# Altium project 388D_Control_v1.PrjPcb (part 2 of 3)

## Sheet 3.ADC.SchDoc
size A3; SheetNumber: 4; SheetTotal: 10
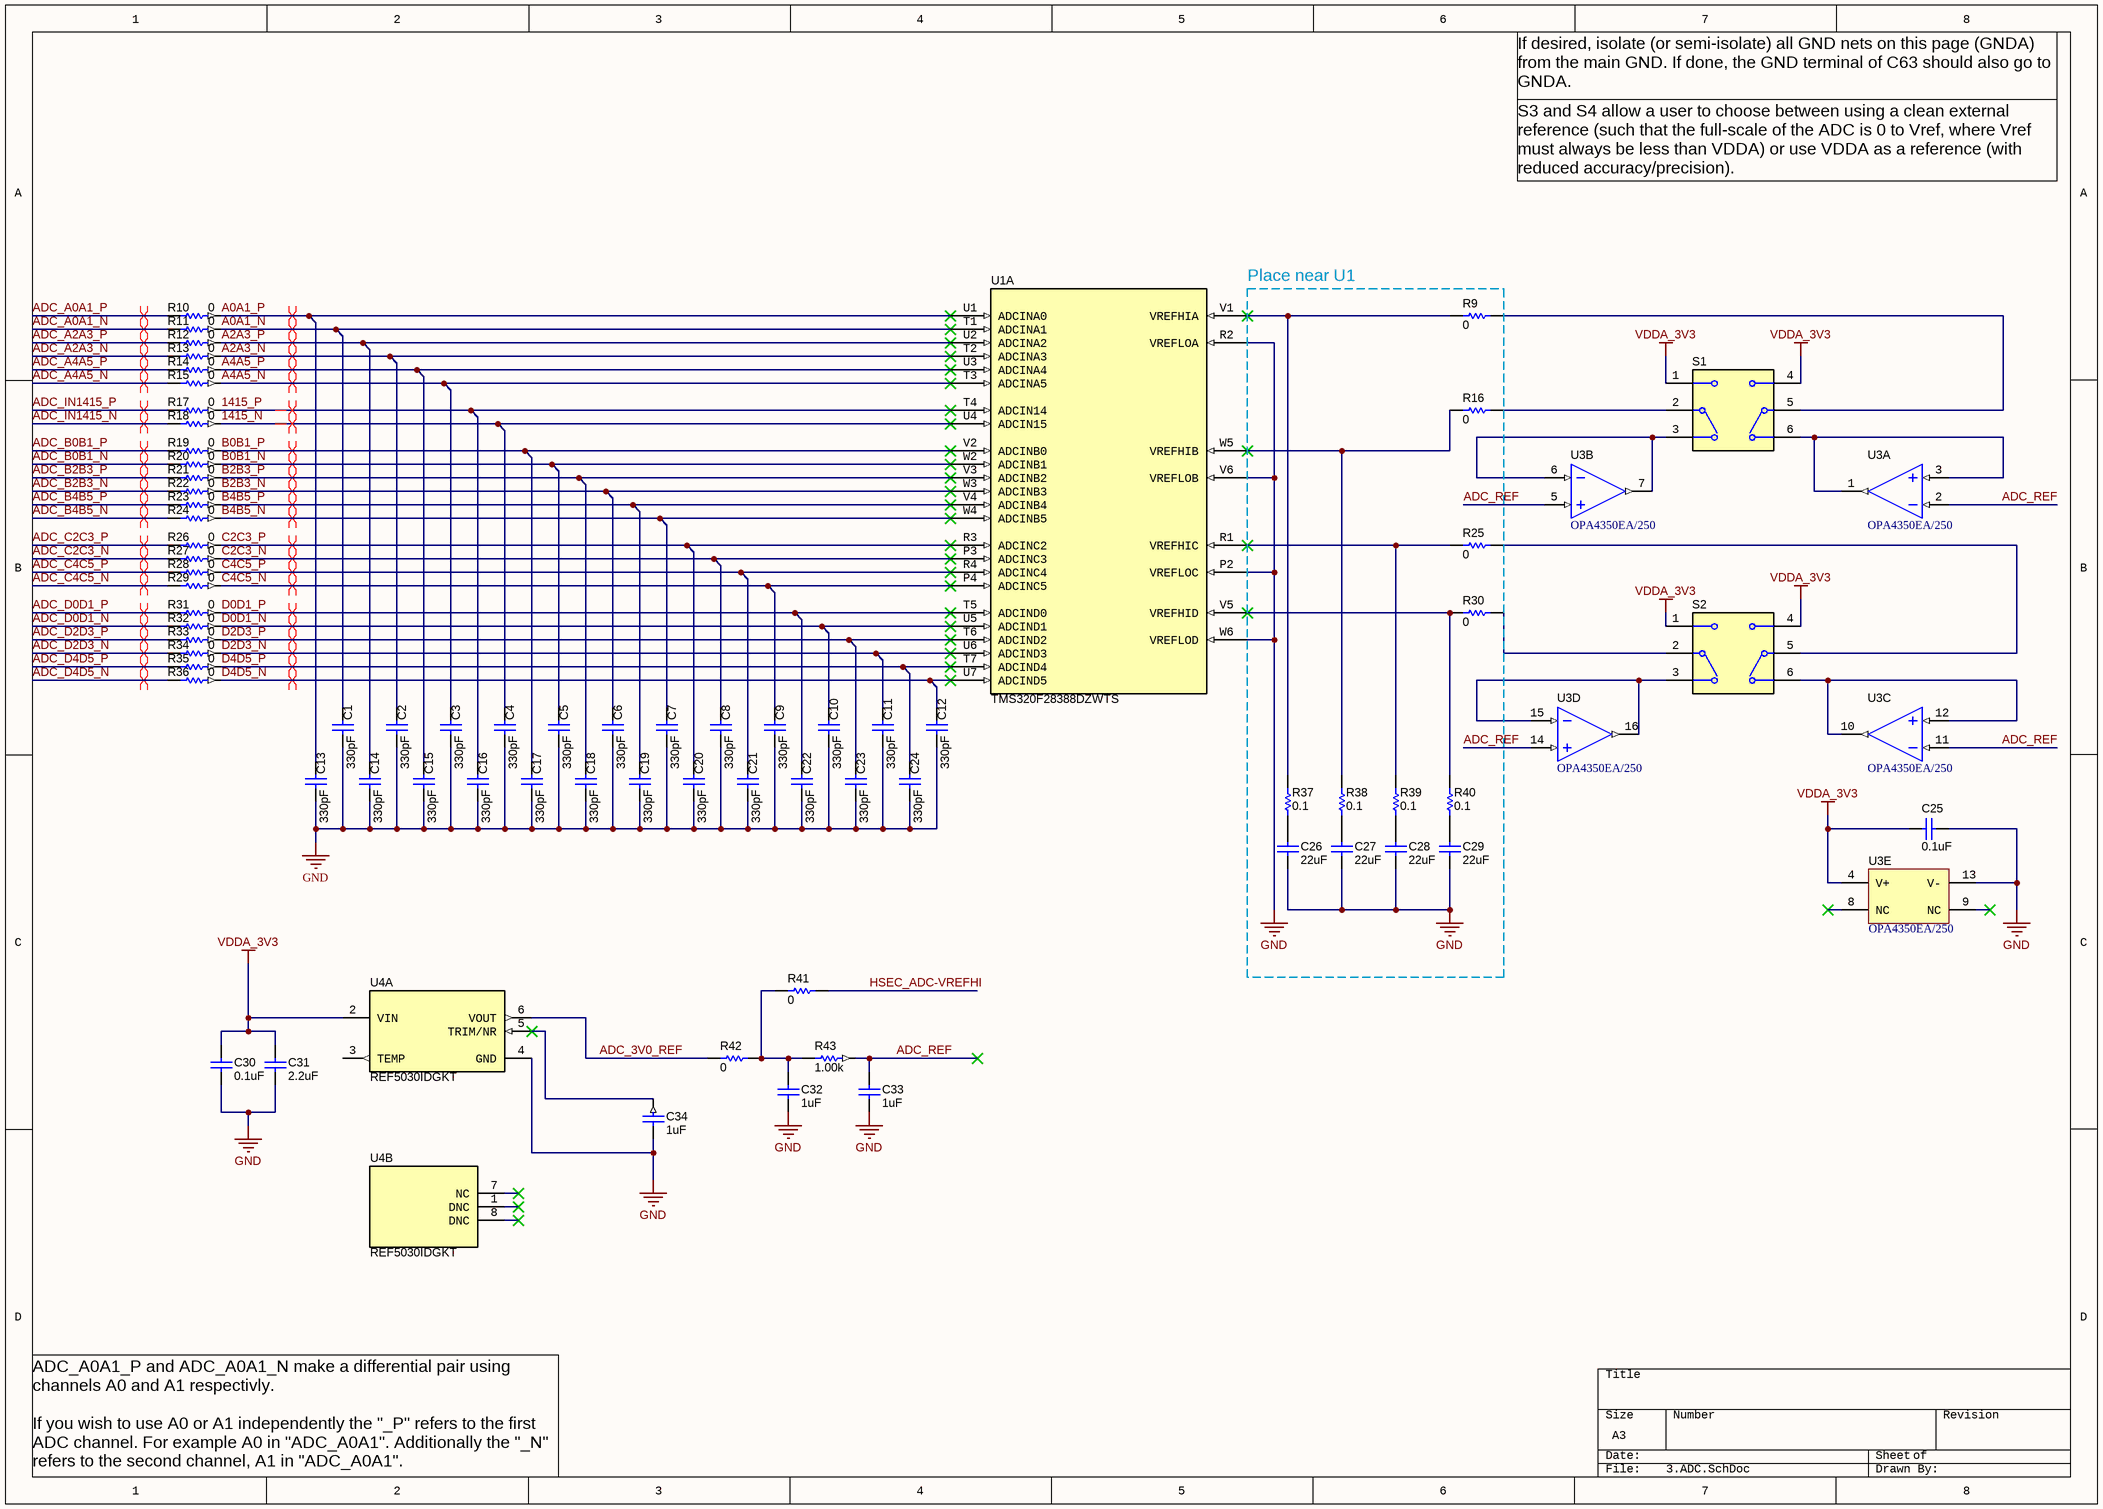
[diagram p3: 3.ADC.SchDoc]

### Parts
(Parts that share a designator on the sheet are numbered #1, #2 ... from top to bottom, then left to right.)
C1  ValueDisplayed: 330pF  [0603]  (hidden comment: C0603C331J5GACTU)
C2  ValueDisplayed: 330pF  [0603]  (hidden comment: C0603C331J5GACTU)
C3  ValueDisplayed: 330pF  [0603]  (hidden comment: C0603C331J5GACTU)
C4  ValueDisplayed: 330pF  [0603]  (hidden comment: C0603C331J5GACTU)
C5  ValueDisplayed: 330pF  [0603]  (hidden comment: C0603C331J5GACTU)
C6  ValueDisplayed: 330pF  [0603]  (hidden comment: C0603C331J5GACTU)
C7  ValueDisplayed: 330pF  [0603]  (hidden comment: C0603C331J5GACTU)
C8  ValueDisplayed: 330pF  [0603]  (hidden comment: C0603C331J5GACTU)
C9  ValueDisplayed: 330pF  [0603]  (hidden comment: C0603C331J5GACTU)
C10  ValueDisplayed: 330pF  [0603]  (hidden comment: C0603C331J5GACTU)
C11  ValueDisplayed: 330pF  [0603]  (hidden comment: C0603C331J5GACTU)
C12  ValueDisplayed: 330pF  [0603]  (hidden comment: C0603C331J5GACTU)
C13  ValueDisplayed: 330pF  [0603]  (hidden comment: C0603C331J5GACTU)
C14  ValueDisplayed: 330pF  [0603]  (hidden comment: C0603C331J5GACTU)
C15  ValueDisplayed: 330pF  [0603]  (hidden comment: C0603C331J5GACTU)
C16  ValueDisplayed: 330pF  [0603]  (hidden comment: C0603C331J5GACTU)
C17  ValueDisplayed: 330pF  [0603]  (hidden comment: C0603C331J5GACTU)
C18  ValueDisplayed: 330pF  [0603]  (hidden comment: C0603C331J5GACTU)
C19  ValueDisplayed: 330pF  [0603]  (hidden comment: C0603C331J5GACTU)
C20  ValueDisplayed: 330pF  [0603]  (hidden comment: C0603C331J5GACTU)
C21  ValueDisplayed: 330pF  [0603]  (hidden comment: C0603C331J5GACTU)
C22  ValueDisplayed: 330pF  [0603]  (hidden comment: C0603C331J5GACTU)
C23  ValueDisplayed: 330pF  [0603]  (hidden comment: C0603C331J5GACTU)
C24  ValueDisplayed: 330pF  [0603]  (hidden comment: C0603C331J5GACTU)
C25  ValueDisplayed: 0.1uF  [0603]  (hidden comment: C0603C104K8RACTU)
C26  ValueDisplayed: 22uF  [0603]  (hidden comment: GRM188R61A226ME15D)
C27  ValueDisplayed: 22uF  [0603]  (hidden comment: GRM188R61A226ME15D)
C28  ValueDisplayed: 22uF  [0603]  (hidden comment: GRM188R61A226ME15D)
C29  ValueDisplayed: 22uF  [0603]  (hidden comment: GRM188R61A226ME15D)
C30  ValueDisplayed: 0.1uF  [0603]  (hidden comment: C0603C104K8RACTU)
C31  ValueDisplayed: 2.2uF  [0603]  (hidden comment: C0603C225K9PACTU)
C32  ValueDisplayed: 1uF  [0603]  (hidden comment: C0603C105Z9VACTU)
C33  ValueDisplayed: 1uF  [0603]  (hidden comment: C0603C105Z9VACTU)
C34  ValueDisplayed: 1uF  [0603]  (hidden comment: C0603C105Z9VACTU)
R9  ValueDisplayed: 0  [0603]  (hidden comment: CRCW06030000Z0EA)
R10  ValueDisplayed: 0  [0603]  (hidden comment: CRCW06030000Z0EA)
R11  ValueDisplayed: 0  [0603]  (hidden comment: CRCW06030000Z0EA)
R12  ValueDisplayed: 0  [0603]  (hidden comment: CRCW06030000Z0EA)
R13  ValueDisplayed: 0  [0603]  (hidden comment: CRCW06030000Z0EA)
R14  ValueDisplayed: 0  [0603]  (hidden comment: CRCW06030000Z0EA)
R15  ValueDisplayed: 0  [0603]  (hidden comment: CRCW06030000Z0EA)
R16  ValueDisplayed: 0  [0603]  (hidden comment: CRCW06030000Z0EA)
R17  ValueDisplayed: 0  [0603]  (hidden comment: CRCW06030000Z0EA)
R18  ValueDisplayed: 0  [0603]  (hidden comment: CRCW06030000Z0EA)
R19  ValueDisplayed: 0  [0603]  (hidden comment: CRCW06030000Z0EA)
R20  ValueDisplayed: 0  [0603]  (hidden comment: CRCW06030000Z0EA)
R21  ValueDisplayed: 0  [0603]  (hidden comment: CRCW06030000Z0EA)
R22  ValueDisplayed: 0  [0603]  (hidden comment: CRCW06030000Z0EA)
R23  ValueDisplayed: 0  [0603]  (hidden comment: CRCW06030000Z0EA)
R24  ValueDisplayed: 0  [0603]  (hidden comment: CRCW06030000Z0EA)
R25  ValueDisplayed: 0  [0603]  (hidden comment: CRCW06030000Z0EA)
R26  ValueDisplayed: 0  [0603]  (hidden comment: CRCW06030000Z0EA)
R27  ValueDisplayed: 0  [0603]  (hidden comment: CRCW06030000Z0EA)
R28  ValueDisplayed: 0  [0603]  (hidden comment: CRCW06030000Z0EA)
R29  ValueDisplayed: 0  [0603]  (hidden comment: CRCW06030000Z0EA)
R30  ValueDisplayed: 0  [0603]  (hidden comment: CRCW06030000Z0EA)
R31  ValueDisplayed: 0  [0603]  (hidden comment: CRCW06030000Z0EA)
R32  ValueDisplayed: 0  [0603]  (hidden comment: CRCW06030000Z0EA)
R33  ValueDisplayed: 0  [0603]  (hidden comment: CRCW06030000Z0EA)
R34  ValueDisplayed: 0  [0603]  (hidden comment: CRCW06030000Z0EA)
R35  ValueDisplayed: 0  [0603]  (hidden comment: CRCW06030000Z0EA)
R36  ValueDisplayed: 0  [0603]  (hidden comment: CRCW06030000Z0EA)
R37  ValueDisplayed: 0.1  [0402]  (hidden comment: ERJ2BWFR100X)
R38  ValueDisplayed: 0.1  [0402]  (hidden comment: ERJ2BWFR100X)
R39  ValueDisplayed: 0.1  [0402]  (hidden comment: ERJ2BWFR100X)
R40  ValueDisplayed: 0.1  [0402]  (hidden comment: ERJ2BWFR100X)
R41  ValueDisplayed: 0  [0603]  (hidden comment: CRCW06030000Z0EA)
R42  ValueDisplayed: 0  [0603]  (hidden comment: CRCW06030000Z0EA)
R43  ValueDisplayed: 1.00k  [0603]  (hidden comment: RC0603FR-071KL)
S1  CAS-D20TA  [SW_CAS-D20TA]  (value not drawn)
S2  CAS-D20TA  [SW_CAS-D20TA]  (value not drawn)
U1#2  TMS320F28388DZWTS  [ZWT0337A-IPC_B]  (part A of 5)
U3  OPA4350EA/250  [DBQ0016A_N]  (parts A,B,C,D,E of 5)
U4  REF5030IDGKT  [DGK0008A_N]  (parts A,B of 2)

### Nets
GND: C1.2 C2.2 C3.2 C4.2 C5.2 C6.2 C7.2 C8.2 C9.2 C10.2 C11.2 C12.2 C13.2 C14.2 C15.2 C16.2 C17.2 C18.2 C19.2 C20.2 C21.2 C22.2 C23.2 C24.2 C25.1 C26.2 C27.2 C28.2 C29.2 C30.2 C31.2 C32.2 C33.2 C34.2 U1#2.P2(VREFLOC) U1#2.R2(VREFLOA) U1#2.V6(VREFLOB) U1#2.W6(VREFLOD) U3.13(V-) U4.4(GND)
VDDA_3V3: C25.2 C30.1 C31.1 S1.1 S1.4 S2.1 S2.4 U3.4(V+) U4.2(VIN)
1415_N: C4.1 R18.1 U1#2.U4(ADCIN15)
1415_P: C16.1 R17.1 U1#2.T4(ADCIN14)
A0A1_N: C1.1 R11.1 U1#2.T1(ADCINA1)
A0A1_P: C13.1 R10.1 U1#2.U1(ADCINA0)
A2A3_N: C2.1 R13.1 U1#2.T2(ADCINA3)
A2A3_P: C14.1 R12.1 U1#2.U2(ADCINA2)
A4A5_N: C3.1 R15.1 U1#2.T3(ADCINA5)
A4A5_P: C15.1 R14.1 U1#2.U3(ADCINA4)
ADC_3V0_REF: R42.2 U4.6(VOUT)
ADC_A0A1_N: R11.2
ADC_A0A1_P: R10.2
ADC_A2A3_N: R13.2
ADC_A2A3_P: R12.2
ADC_A4A5_N: R15.2
ADC_A4A5_P: R14.2
ADC_B0B1_N: R20.2
ADC_B0B1_P: R19.2
ADC_B2B3_N: R22.2
ADC_B2B3_P: R21.2
ADC_B4B5_N: R24.2
ADC_B4B5_P: R23.2
ADC_C2C3_N: R27.2
ADC_C2C3_P: R26.2
ADC_C4C5_N: R29.2
ADC_C4C5_P: R28.2
ADC_D0D1_N: R32.2
ADC_D0D1_P: R31.2
ADC_D2D3_N: R34.2
ADC_D2D3_P: R33.2
ADC_D4D5_N: R36.2
ADC_D4D5_P: R35.2
ADC_IN1415_N: R18.2
ADC_IN1415_P: R17.2
ADC_REF: C33.1 R43.2 U3.2(IN_A-) U3.5(IN_B+) U3.11(IN_C-) U3.14(IN_D+)
B0B1_N: C5.1 R20.1 U1#2.W2(ADCINB1)
B0B1_P: C17.1 R19.1 U1#2.V2(ADCINB0)
B2B3_N: C6.1 R22.1 U1#2.W3(ADCINB3)
B2B3_P: C18.1 R21.1 U1#2.V3(ADCINB2)
B4B5_N: C7.1 R24.1 U1#2.W4(ADCINB5)
B4B5_P: C19.1 R23.1 U1#2.V4(ADCINB4)
C2C3_N: C8.1 R27.1 U1#2.P3(ADCINC3)
C2C3_P: C20.1 R26.1 U1#2.R3(ADCINC2)
C4C5_N: C9.1 R29.1 U1#2.P4(ADCINC5)
C4C5_P: C21.1 R28.1 U1#2.R4(ADCINC4)
D0D1_N: C10.1 R32.1 U1#2.U5(ADCIND1)
D0D1_P: C22.1 R31.1 U1#2.T5(ADCIND0)
D2D3_N: C11.1 R34.1 U1#2.U6(ADCIND3)
D2D3_P: C23.1 R33.1 U1#2.T6(ADCIND2)
D4D5_N: C12.1 R36.1 U1#2.U7(ADCIND5)
D4D5_P: C24.1 R35.1 U1#2.T7(ADCIND4)
HSEC_ADC-VREFHI: R41.1
NetC26_1: C26.1 R37.2
NetC27_1: C27.1 R38.2
NetC28_1: C28.1 R39.2
NetC29_1: C29.1 R40.2
NetC32_1: C32.1 R41.2 R42.1 R43.1
NetC34_1: C34.1 U4.5(TRIM/NR)
NetR9_1: R9.1 S1.5(C)
NetR9_2: R9.2 R37.1 U1#2.V1(VREFHIA)
NetR16_1: R16.1 S1.2(C)
NetR16_2: R16.2 R38.1 U1#2.W5(VREFHIB)
NetR25_1: R25.1 S2.5(C)
NetR25_2: R25.2 R39.1 U1#2.R1(VREFHIC)
NetR30_1: R30.1 S2.2(C)
NetR30_2: R30.2 R40.1 U1#2.V5(VREFHID)
NetS1_3: S1.3 U3.6(IN_B-) U3.7(OUT_B)
NetS1_6: S1.6 U3.1(OUT_A) U3.3(IN_A+)
NetS2_3: S2.3 U3.15(IN_D-) U3.16(OUT_D)
NetS2_6: S2.6 U3.10(OUT_C) U3.12(IN_C+)

Not connected (* = marked no-connect by the designer): U3 8(NC)* 9(NC)*; U4 1(DNC)* 3(TEMP) 7(NC)* 8(DNC)*

### Layout directives
differential pair: 1415_N, 1415_P, A0A1_N, A0A1_P, A2A3_N, A2A3_P, A4A5_N, A4A5_P, ADC_A0A1_N, ADC_A0A1_P, ADC_A2A3_N, ADC_A2A3_P, ADC_A4A5_N, ADC_A4A5_P, ADC_B0B1_N, ADC_B0B1_P, ADC_B2B3_N, ADC_B2B3_P, ADC_B4B5_N, ADC_B4B5_P, ADC_C2C3_N, ADC_C2C3_P, ADC_C4C5_N, ADC_C4C5_P, ADC_D0D1_N, ADC_D0D1_P, ADC_D2D3_N, ADC_D2D3_P, ADC_D4D5_N, ADC_D4D5_P, ADC_IN1415_N, ADC_IN1415_P, B0B1_N, B0B1_P, B2B3_N, B2B3_P, B4B5_N, B4B5_P, C2C3_N, C2C3_P, C4C5_N, C4C5_P, D0D1_N, D0D1_P, D2D3_N, D2D3_P, D4D5_N, D4D5_P

### Notes on the sheet
- If desired, isolate (or semi-isolate) all GND nets on this page (GNDA) from the main GND. If done, the GND terminal of C63 should also go to GNDA.
- S3 and S4 allow a user to choose between using a clean external reference (such that the full-scale of the ADC is 0 to Vref, where Vref must always be less than VDDA) or use VDDA as a reference (with reduced accuracy/precision).
- (near U1#2) Place near U1
- ADC_A0A1_P and ADC_A0A1_N make a differential pair using channels A0 and A1 respectivly.
  If you wish to use A0 or A1 independently the "_P" refers to the first ADC channel. For example A0 in "ADC_A0A1". Additionally the "_N" refers to the second channel, A1 in "ADC_A0A1".

### Library data of the parts
C1-C24 = CMP-0006920-4: CAP, CERM, 330 pF, 50 V, +/- 5%, C0G/NP0, 0603; Manufacturer: Kemet; TaMin_C: -55°C; Polarized: N; SizeAreaWB_mm2: 4.68; Value1: Unknown; U/M: EA; Value: 330pF; TaMax_C: 125°C; SizeZ_mm: 1; SizeX_mm: 1.6; SizeY_mm: 0.8; Value2: 50V; SizeArea_mm2: 1.28; AEC Category: Q200; Supplier Part Number 2: 80-C0603C331J5G; Publisher: Texas Instruments; Supplier 2: Mouser; Supplier Part Number 3: 1414634; TempCo: C0G/NP0; Supplier 3: Farnell; Published: 2008-06-19; RoHS: Y; MountType: SMT; Supplier 1: Digi-Key; PackageReference: 0603; Tolerance_%: 5%; Cap_Case: 0603; CompType: Capacitor; LatestRevisionDate: 2017-03-09; PartNumber: C0603C331J5GACTU; AEC Qualified: ?; Cap_F: 330pF; ComponentLink1Description: Datasheet link; Supplier Part Number 1: 399-1068-1-ND; Technology: Ceramic; ComponentLink1URL: http://www.kemet.com/kemet/web/homepage/kechome.nsf/vapubfiles/F3102_Y5V.pdf/$file/F3102_Y5V.pdf
C25 C30 = CMP-0006862-5: CAP, CERM, 0.1 uF, 10 V, +/- 10%, X7R, 0603; Manufacturer: Kemet; TaMin_C: -55°C; Polarized: N; SizeAreaWB_mm2: 4.68; Value1: Unknown; U/M: EA; Value: 0.1uF; TaMax_C: 125°C; SizeZ_mm: 1; SizeX_mm: 1.6; SizeY_mm: 0.8; Value2: 10V; SizeArea_mm2: 1.28; Cap_F: 100nF; AEC Category: Q200; Supplier Part Number 2: 80-C0603C104K8R; Publisher: Texas Instruments; Supplier 2: Mouser; Supplier Part Number 3: 1640032; TempCo: X7R; Supplier 3: Farnell; Published: 2008-06-19; RoHS: Y; MountType: SMT; Supplier 1: Digi-Key; PackageReference: 0603; Tolerance_%: 10%; Cap_Case: 0603; CompType: Capacitor; LatestRevisionDate: 2017-03-09; PartNumber: C0603C104K8RACTU; AEC Qualified: ?; ComponentLink1Description: Datasheet link; Supplier Part Number 1: 399-1095-1-ND; Technology: Ceramic; ComponentLink1URL: http://www.kemet.com/kemet/web/homepage/kechome.nsf/vapubfiles/F3102_Y5V.pdf/$file/F3102_Y5V.pdf
C26-C29 = CMP-0007324-5: CAP, CERM, 22 uF, 10 V, +/- 20%, X5R, 0603; Manufacturer: MuRata; TaMin_C: -55°C; Polarized: N; SizeAreaWB_mm2: 4.68; Value1: Unknown; U/M: EA; Value: 22uF; TaMax_C: 85°C; SizeZ_mm: 1; SizeX_mm: 1.6; SizeY_mm: 0.8; Value2: 10V; SizeArea_mm2: 1.28; Cap_F: 22µF; AEC Category: Q200; Supplier Part Number 2: 68X2786; Publisher: Texas Instruments; Supplier 2: Newark; Supplier Part Number 3: 81-GRM188R61A226ME5D; TempCo: X5R; Supplier 3: Mouser; Published: 2008-06-19; RoHS: Y; MountType: SMT; Supplier 1: Digi-Key; PackageReference: 0603; Tolerance_%: 20%; Cap_Case: 0603; CompType: Capacitor; LatestRevisionDate: 2017-03-09; PartNumber: GRM188R61A226ME15D; AEC Qualified: ?; ComponentLink1Description: Datasheet link; Supplier Part Number 1: 490-10476-1-ND; Technology: Ceramic; ComponentLink1URL: http://psearch.murata.com/capacitor/product/GRM188R61A226ME15%23.pdf
C31 = CMP-0006907-5: CAP, CERM, 2.2 uF, 6.3 V, +/- 10%, X5R, 0603; Manufacturer: Kemet; TaMin_C: -55°C; Polarized: N; SizeAreaWB_mm2: 4.68; Value1: Unknown; U/M: EA; Value: 2.2uF; TaMax_C: 85°C; SizeZ_mm: 1; SizeX_mm: 1.6; SizeY_mm: 0.8; Value2: 6.3V; SizeArea_mm2: 1.28; Cap_F: 2.2µF; AEC Category: Q200; Supplier Part Number 2: 80-C0603C225K9P; Publisher: Texas Instruments; Supplier 2: Mouser; Supplier Part Number 3: 1288257; TempCo: X5R; Supplier 3: Farnell; Published: 2008-06-19; RoHS: Y; MountType: SMT; Supplier 1: Digi-Key; PackageReference: 0603; Tolerance_%: 10%; Cap_Case: 0603; CompType: Capacitor; LatestRevisionDate: 2017-03-09; PartNumber: C0603C225K9PACTU; AEC Qualified: ?; ComponentLink1Description: Datasheet link; Supplier Part Number 1: 399-3362-1-ND; Technology: Ceramic; ComponentLink1URL: http://www.kemet.com/kemet/web/homepage/kechome.nsf/vapubfiles/F3102_Y5V.pdf/$file/F3102_Y5V.pdf
C32-C34 = CMP-0006871-4: CAP, CERM, 1 uF, 6.3 V, +80/-20%, Y5V, 0603; Manufacturer: Kemet; TaMin_C: -30°C; Polarized: N; SizeAreaWB_mm2: 4.68; Value1: Unknown; U/M: EA; Value: 1uF; TaMax_C: 85°C; Tolerance_%: 80%; SizeZ_mm: 1; SizeX_mm: 1.6; SizeY_mm: 0.8; Value2: 6.3V; SizeArea_mm2: 1.28; Cap_F: 1µF; AEC Category: Q200; Supplier Part Number 2: 80-C0603C105Z9V; Publisher: Texas Instruments; Supplier 2: Mouser; Supplier Part Number 3: 1515067; TempCo: Y5V; Supplier 3: Farnell; Published: 2008-06-19; RoHS: Y; MountType: SMT; Supplier 1: Digi-Key; PackageReference: 0603; Cap_Case: 0603; CompType: Capacitor; LatestRevisionDate: 2017-03-09; PartNumber: C0603C105Z9VACTU; AEC Qualified: ?; ComponentLink1Description: Datasheet link; Supplier Part Number 1: 399-3217-1-ND; Technology: Ceramic; ComponentLink1URL: http://www.kemet.com/kemet/web/homepage/kechome.nsf/vapubfiles/F3102_Y5V.pdf/$file/F3102_Y5V.pdf
R9-R36 R41 R42 = CMP-0025697-4: RES, 0, 5%, 0.1 W, AEC-Q200 Grade 0, 0603; Manufacturer: Vishay-Dale; Value: 0; Value_Code: 0000; Power_W: 100mW; Value2: 0.1W; VDC_V: 75V; TempCo: 200 ppm/C; EIA_Code: E24; AEC Category: Q200; AEC Qualified: Y; SizeArea_mm2: 1.28; SizeX_mm: 1.6; SizeY_mm: 0.8; SizeZ_mm: 1; CompType: Resistor; PartNumber: CRCW06030000Z0EA; PackageReference: 0603; RoHS: E; Res_ohm: 0; Tolerance_%: 5%; Value1: 5%; MountType: SMT; Technology: Thick Film; ComponentLink1Description: Datasheet link; ComponentLink1URL: http://www.vishay.com/docs/20035/dcrcwe3.pdf; Supplier 1: Digi-Key; Supplier Part Number 1: 541-0.0GCT-ND; Supplier 2: Newark; Supplier Part Number 2: 52K8014; Supplier 3: Mouser; Supplier Part Number 3: 71-CRCW0603-0-E3; AEC Grade: 0
R37-R40 = CMP-0078660-1: RES, 0.1, 1%, 0.25 W, 0402; Manufacturer: Panasonic; Power_W: 250mW; TempCo: 300 ppm/C; Value_Code: R100; Value: 0.1; EIA_Code: E96; Res_ohm: 1d; SizeX_mm: 1; SizeY_mm: 0.5; SizeZ_mm: 0.6; Value2: 0.25W; AEC Qualified: N; AEC Category: Q200; ComponentLink1URL: https://industrial.panasonic.com/cdbs/www-data/pdf/RDN0000/AOA0000C313.pdf; Supplier Part Number 2: 667-ERJ-2BWFR100X; Supplier 2: Mouser; RoHS: Y; Value1: 1%; MountType: SMT; Supplier 1: Digi-Key; PackageReference: 0402; Tolerance_%: 1%; SizeArea_mm2: 0.5; CompType: Resistor; PartNumber: ERJ2BWFR100X; ComponentLink1Description: Datasheet link; AEC Grade: N/A; Supplier Part Number 1: P17368CT-ND; Technology: Thick Film
R43 = CMP-0022895-5: RES, 1.00 k, 1%, 0.1 W, 0603; Manufacturer: Yageo; Power_W: 100mW; TempCo: 100 ppm/C; Value_Code: 1k00; Value: 1.00k; EIA_Code: E96; Res_ohm: 1k; SizeX_mm: 1.6; SizeY_mm: 0.8; SizeZ_mm: 1; Value2: 0.1W; SizeArea_mm2: 1.28; AEC Qualified: N; VDC_V: 75V; AEC Category: Q200; SizeAreaWB_mm2: 4.68; Supplier Part Number 2: 603-RC0603FR-071KL; Supplier 2: Mouser; Supplier Part Number 3: 9238484; Supplier 3: Farnell; RoHS: Y; Value1: 1%; MountType: SMT; Supplier 1: Digi-Key; PackageReference: 0603; Tolerance_%: 1%; CompType: Resistor; PartNumber: RC0603FR-071KL; ComponentLink1Description: Datasheet link; Supplier Part Number 1: 311-1.00KHRCT-ND; Technology: Thick Film; ComponentLink1URL: http://www.yageo.com/pdf/Pu-RC0603_51_PbFree_L_2.pdf; AEC Grade: N/A
S1 S2 = CMP-0002233-1: Switch, Dual SPDT,  2 Pos, 0.1A, 6VDC, SMD; Manufacturer: Copal Electronics; CurrentRating_mA: 100A; SwitchFunction: On-On; VDC_V: 6V; PositionCount: 2; ComponentLink1Description: Datasheet Link; LatestRevisionDate: 2017-03-09; PackageReference: 5.4x3.9mm; Publisher: Texas Instruments; Supplier 1: Digi-Key; ComponentLink1URL: http://www.nidec-copal-electronics.com/e/catalog/switch/cas.pdf; Supplier Part Number 1: CASD20JCT-ND; MountType: SMT; Circuit: SPDT; Orientation: Top Actuated; PartNumber: CAS-D20TA; CompType: Switch; RoHS: Y
U1#2 = CMP-012-000147-1: as U1#1 on sheet 2.Support; ComponentLink2URL: http://www.ti.com/product/tms320f28388d; MountType: SMT; ComponentLink3Description: Online Datasheet; PackageDescription: NFBGA-337; ComponentLink3URL: http://www.ti.com/product/tms320f28388d/datasheet; SizeX_mm: 16; Design Item ID: TMS320F28388DZWTS; ComponentLink1URL: http://www.ti.com/lit/ds/symlink/tms320f28388d.pdf; Source: SamacSys.SchLib; ComponentLink2Description: Product Folder; PackageReference: ZWT0337A; Manufacturer: Texas Instruments; ComponentLink1Description: Datasheet Link
U3 = CMP-014-00004-2: High-Speed, Single-Supply, Rail-to-Rail Operational Amplifier MicroAmplifier(TM) Series, 2.7 to 5.5 V, -55 to 150 degC, 16-pin SOP (DBQ16), Green (RoHS & no Sb/Br); Manufacturer: Texas Instruments; Sub Family: Low Input Bias Current Amp (<=10pA), Low Offset Voltage Amplifier (<=500uV), Low Supply Voltage Amplifier (<=2.7V), Precision Amplifier; Iq per channel(Max)(mA): 7.5; Slew Rate(Typ)(V/us): 22; Vn at 1kHz(Typ)(nV/rtHz): 18; CMRR(Min)(dB): 66; Available Preview Images: 2D; IIB(Max)(pA): 10; Total Supply Voltage(Min)(+5V is 5, +/-5V is 10): 2.7; Number of Channels: 4; Vio (25C)(Max)(mV): 0.5; Total Supply Voltage(Max)(+5V is 5, +/-5V is 10): 5.5; Eco-Plan: Green (RoHS & no Sb/Br); PackageVersion: 4073301-2/H, 10/2008; ComponentLink3URL: http://www.ti.com/litv/pdf/msoi004g; Mounting Technology: Surface Mount; ComponentLink2Description: Datasheet; ComponentLink1Description: Manufacturer URL; ComponentLink1URL: http://www.ti.com/; PackageReference: DBQ0016A; ComponentLink2URL: http://www.ti.com/general/docs/lit/getliterature.tsp?genericPartNumber=OPA4350&fileType=pdf; Code_JEDEC: MO-137; Design Item ID: CMP-0041147-1; DatasheetVersion: SBOS099C; Offset Drift(Typ)(uV/C): 4; Case/Package: 16-Pin, Plastic Small Outline, Body 3.9 x 4.9 mm, Pitch 0.635 mm; Source: SamacSys.SchLib; ComponentLink3Description: Package Specification
U4 = CMP-0032596-2: Low Noise, Very Low Drift, Precision Series Voltage Reference, DGK0008A (VSSOP-8); Manufacturer: Texas Instruments; Temp Coeff(Max)(ppm/ degree C): 3; Iout/Iz(Max)(mA): 10; VI(Min)(V): 3.2; Eco-Plan: Green (RoHS & no Sb/Br); Initial Accuracy @ 25/deg C(%): 0.05; Iq(Max)(uA): 1000; VI(Max)(V): 18; Rating: Catalog; AEC Category: Q200; AEC Qualified: N; CompType: IC; SizeAreaWB_mm2: 23.6; SizeArea_mm2: 14.7; SizeX_mm: 4.9; SizeZ_mm: 1.1; PackageDescription: VSSOP-8; ComponentLink3URL: http://www.ti.com/product/ref5030/datasheet; PackageVersion: 4073329/E; DatasheetVersion: SBOS410E; VO(V): 3; PartNumber: REF5030IDGKT; ComponentLink3Description: Online Datasheet; ComponentLink2URL: http://www.ti.com/product/ref5030; ComponentLink1Description: Datasheet Link; Code_JEDEC: MO-187-AA; PackageReference: DGK0008A; SubFamily: Series Voltage Reference; ComponentLink1URL: http://www.ti.com/lit/ds/symlink/ref5030.pdf; ComponentLink2Description: Product Folder; MountType: SMT; RoHS: Y; SizeY_mm: 3

## Sheet 4.Power.SchDoc
size A3; CompanyName: Peets; DrawnBy: Harry Lee; SheetNumber: 5; SheetTotal: 10
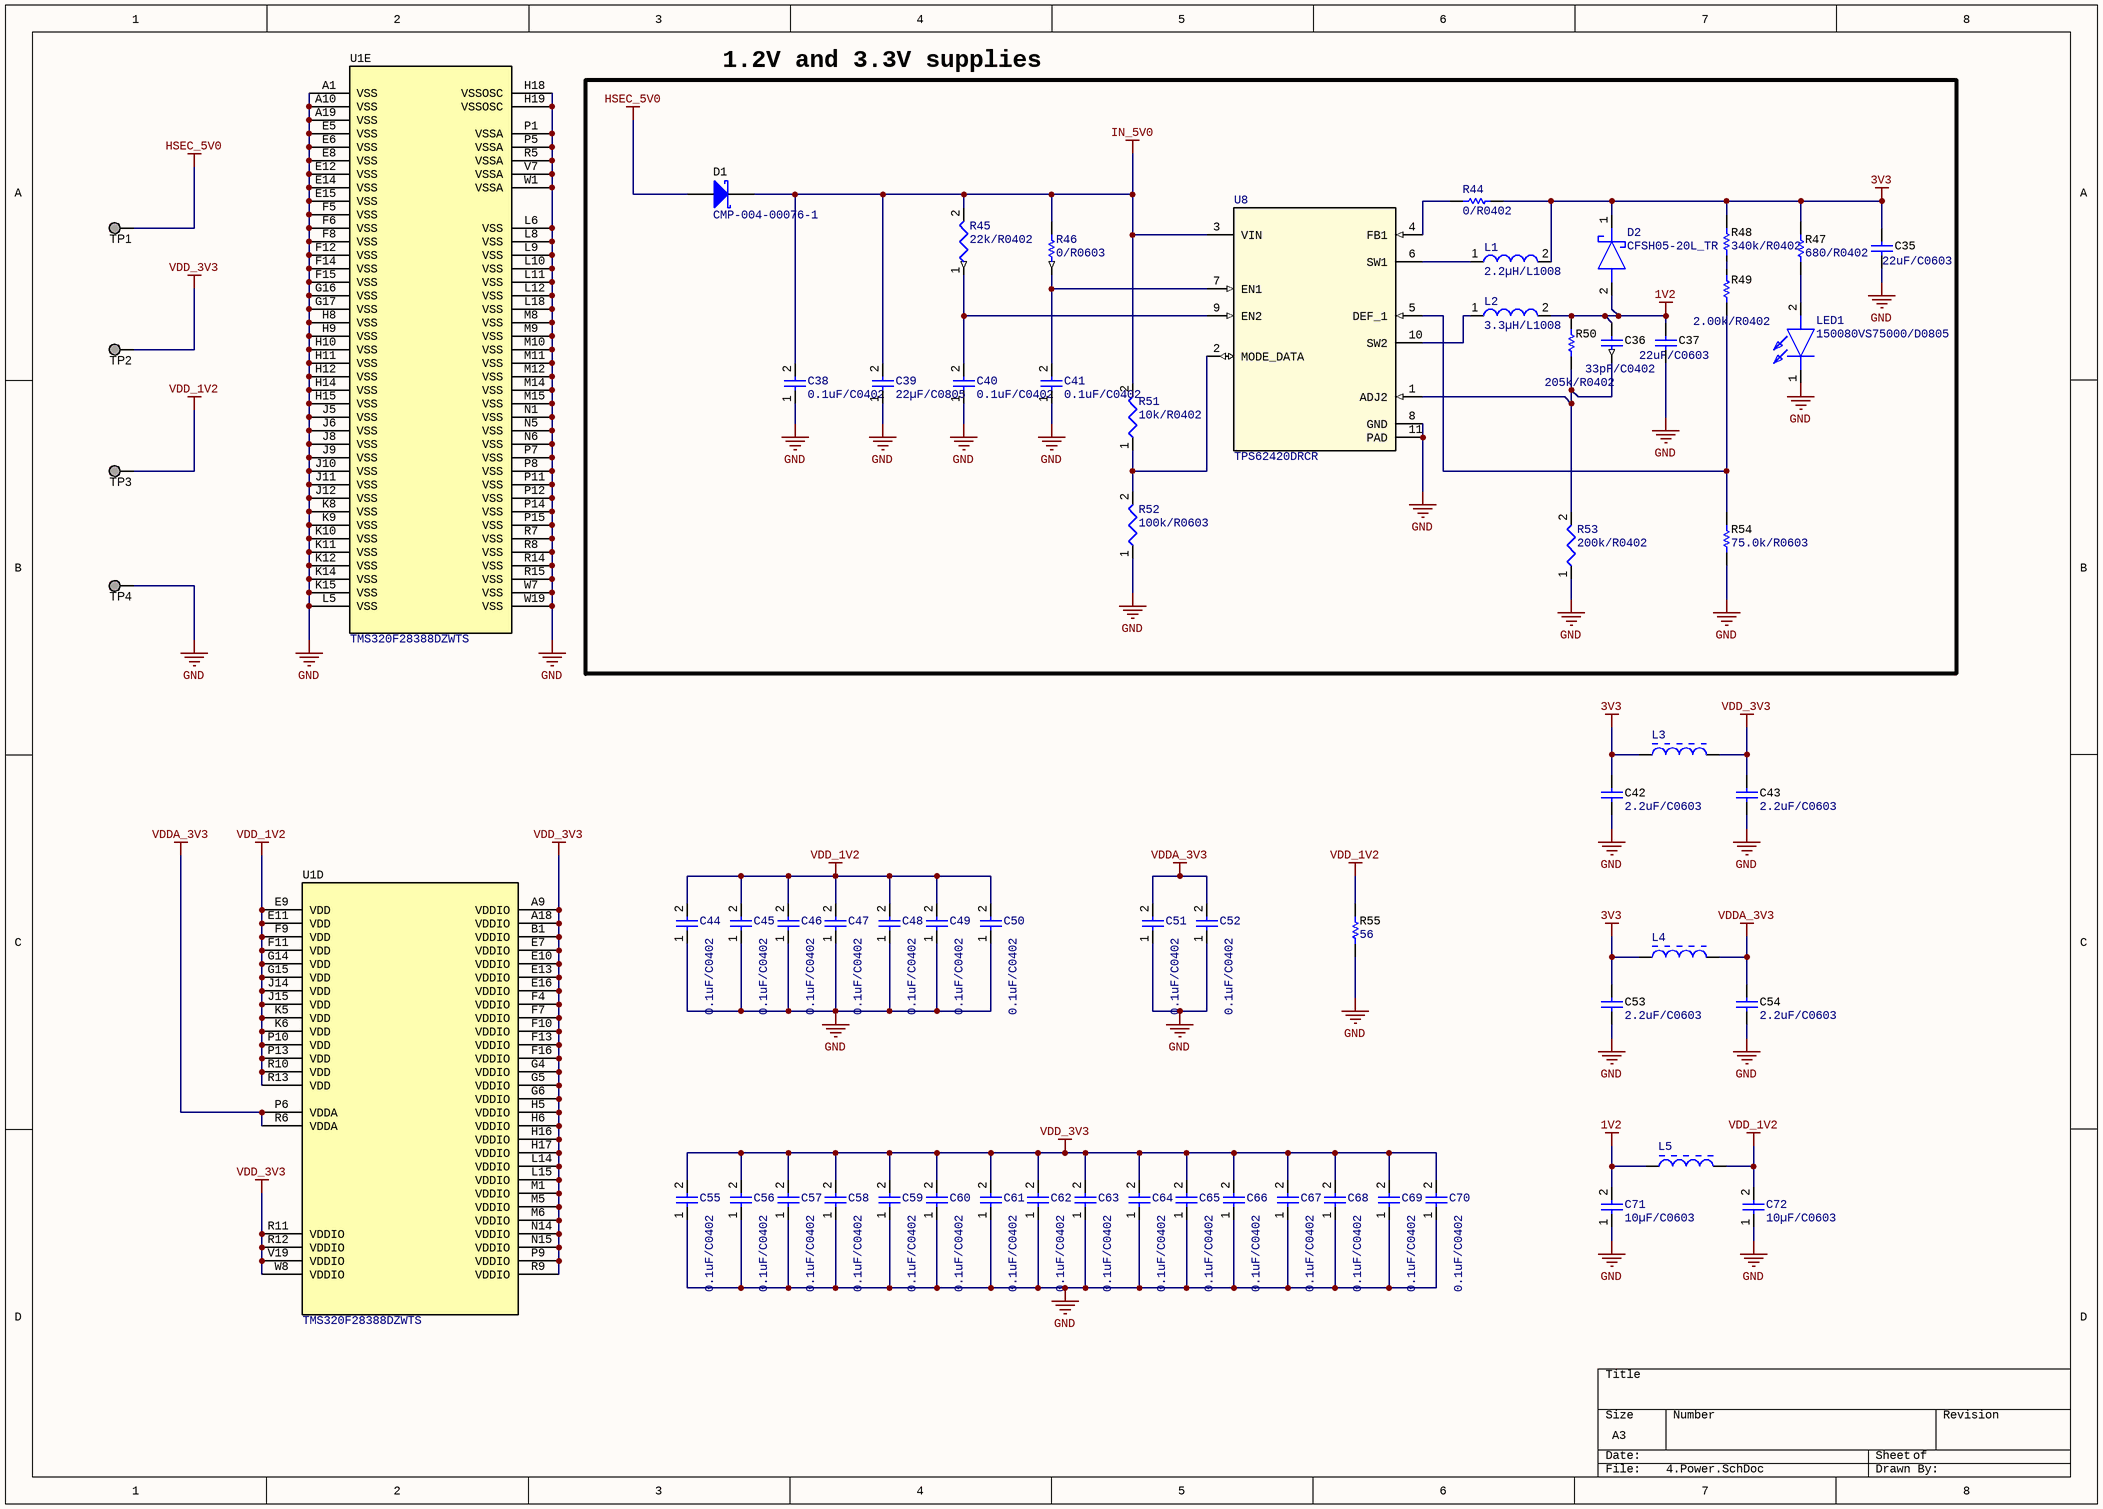
[diagram p4: 4.Power.SchDoc]

### Parts
(Parts that share a designator on the sheet are numbered #1, #2 ... from top to bottom, then left to right.)
C35  ValueDisplayed: 22uF/C0603  [0603]  (hidden comment: GRM188R61A226ME15D)
C36  ValueDisplayed: 33pF/C0402  [0402]  (hidden comment: 885012005043)
C37  ValueDisplayed: 22uF/C0603  [0603]  (hidden comment: GRM188R61A226ME15D)
C38  value 0.1uF/C0402  [CAPC1005X56X25LL10T15]  (hidden comment: Capacitor 0.1 uF +/- 5% 16 V 0402)
C39  value 22µF/C0805  [CAPC0805(2012)145_L]  (hidden comment: Capacitor 22µF +/-40% 16V 0805)
C40  value 0.1uF/C0402  [CAPC1005X56X25LL10T15]  (hidden comment: Capacitor 0.1 uF +/- 5% 16 V 0402)
C41  value 0.1uF/C0402  [CAPC1005X56X25LL10T15]  (hidden comment: Capacitor 0.1 uF +/- 5% 16 V 0402)
C42  ValueDisplayed: 2.2uF/C0603  [0603]  (hidden comment: C0603C225K8PACTU)
C43  ValueDisplayed: 2.2uF/C0603  [0603]  (hidden comment: C0603C225K8PACTU)
C44  value 0.1uF/C0402  [CAPC1005X56X25LL10T15]  (hidden comment: Capacitor 0.1 uF +/- 5% 16 V 0402)
C45  value 0.1uF/C0402  [CAPC1005X56X25LL10T15]  (hidden comment: Capacitor 0.1 uF +/- 5% 16 V 0402)
C46  value 0.1uF/C0402  [CAPC1005X56X25LL10T15]  (hidden comment: Capacitor 0.1 uF +/- 5% 16 V 0402)
C47  value 0.1uF/C0402  [CAPC1005X56X25LL10T15]  (hidden comment: Capacitor 0.1 uF +/- 5% 16 V 0402)
C48  value 0.1uF/C0402  [CAPC1005X56X25LL10T15]  (hidden comment: Capacitor 0.1 uF +/- 5% 16 V 0402)
C49  value 0.1uF/C0402  [CAPC1005X56X25LL10T15]  (hidden comment: Capacitor 0.1 uF +/- 5% 16 V 0402)
C50  value 0.1uF/C0402  [CAPC1005X56X25LL10T15]  (hidden comment: Capacitor 0.1 uF +/- 5% 16 V 0402)
C51  value 0.1uF/C0402  [CAPC1005X56X25LL10T15]  (hidden comment: Capacitor 0.1 uF +/- 5% 16 V 0402)
C52  value 0.1uF/C0402  [CAPC1005X56X25LL10T15]  (hidden comment: Capacitor 0.1 uF +/- 5% 16 V 0402)
C53  ValueDisplayed: 2.2uF/C0603  [0603]  (hidden comment: C0603C225K8PACTU)
C54  ValueDisplayed: 2.2uF/C0603  [0603]  (hidden comment: C0603C225K8PACTU)
C55  value 0.1uF/C0402  [CAPC1005X56X25LL10T15]  (hidden comment: Capacitor 0.1 uF +/- 5% 16 V 0402)
C56  value 0.1uF/C0402  [CAPC1005X56X25LL10T15]  (hidden comment: Capacitor 0.1 uF +/- 5% 16 V 0402)
C57  value 0.1uF/C0402  [CAPC1005X56X25LL10T15]  (hidden comment: Capacitor 0.1 uF +/- 5% 16 V 0402)
C58  value 0.1uF/C0402  [CAPC1005X56X25LL10T15]  (hidden comment: Capacitor 0.1 uF +/- 5% 16 V 0402)
C59  value 0.1uF/C0402  [CAPC1005X56X25LL10T15]  (hidden comment: Capacitor 0.1 uF +/- 5% 16 V 0402)
C60  value 0.1uF/C0402  [CAPC1005X56X25LL10T15]  (hidden comment: Capacitor 0.1 uF +/- 5% 16 V 0402)
C61  value 0.1uF/C0402  [CAPC1005X56X25LL10T15]  (hidden comment: Capacitor 0.1 uF +/- 5% 16 V 0402)
C62  value 0.1uF/C0402  [CAPC1005X56X25LL10T15]  (hidden comment: Capacitor 0.1 uF +/- 5% 16 V 0402)
C63  value 0.1uF/C0402  [CAPC1005X56X25LL10T15]  (hidden comment: Capacitor 0.1 uF +/- 5% 16 V 0402)
C64  value 0.1uF/C0402  [CAPC1005X56X25LL10T15]  (hidden comment: Capacitor 0.1 uF +/- 5% 16 V 0402)
C65  value 0.1uF/C0402  [CAPC1005X56X25LL10T15]  (hidden comment: Capacitor 0.1 uF +/- 5% 16 V 0402)
C66  value 0.1uF/C0402  [CAPC1005X56X25LL10T15]  (hidden comment: Capacitor 0.1 uF +/- 5% 16 V 0402)
C67  value 0.1uF/C0402  [CAPC1005X56X25LL10T15]  (hidden comment: Capacitor 0.1 uF +/- 5% 16 V 0402)
C68  value 0.1uF/C0402  [CAPC1005X56X25LL10T15]  (hidden comment: Capacitor 0.1 uF +/- 5% 16 V 0402)
C69  value 0.1uF/C0402  [CAPC1005X56X25LL10T15]  (hidden comment: Capacitor 0.1 uF +/- 5% 16 V 0402)
C70  value 0.1uF/C0402  [CAPC1005X56X25LL10T15]  (hidden comment: Capacitor 0.1 uF +/- 5% 16 V 0402)
C71  value 10µF/C0603  [CAPC0603(1608)100_L]  (hidden comment: Capacitor 10µF +/-20% 10V 0603)
C72  value 10µF/C0603  [CAPC0603(1608)100_L]  (hidden comment: Capacitor 10µF +/-20% 10V 0603)
D1  CMP-004-00076-1  [POWERMITE]
D2  CFSH05-20L_TR  [CFSH0520LTRPBFREE]
L1  value 2.2µH/L1008  [INDC2520X100X60NL20T20]  (hidden comment: LQM2HPN2R2MG0L)
L2  value 3.3µH/L1008  [INDC2520X100X60NL20T20]  (hidden comment: LQM2HPN2R2MG0L)
L3  BLM18AG121SN1D  [MURA-BLM18-F-H1-CHIP-2_V]  (value not drawn)
L4  BLM18AG121SN1D  [MURA-BLM18-F-H1-CHIP-2_V]  (value not drawn)
L5  BLM18AG121SN1D  [MURA-BLM18-F-H1-CHIP-2_V]  (value not drawn)
LED1  150080VS75000/D0805  [LEDC2012X70N]
R44  value 0/R0402  [RESC1005X40X25ML05T05]  (hidden comment: Resistor 0R +/- 5% 0402 100 mW)
R45  value 22k/R0402  [RESC0402(1005)_L]  (hidden comment: 22KR2F)
R46  value 0/R0603  [RESC1608X55X25ML10T15]  (hidden comment: Resistor 0R +/- 5% 0603 100 mW)
R47  ValueDisplayed: 680/R0402  [0402]  (hidden comment: CRCW0402680RJNED)
R48  ValueDisplayed: 340k/R0402  [0402]  (hidden comment: CRCW0402340KFKED)
R49  ValueDisplayed: 2.00k/R0402  [0402]  (hidden comment: ERJ-2RKF2001X)
R50  ValueDisplayed: 205k/R0402  [0402]  (hidden comment: CRCW0402205KFKED)
R51  value 10k/R0402  [RESC0402(1005)_L]  (hidden comment: 10KR2F)
R52  value 100k/R0603  [RESC1608X55X25ML10T15]  (hidden comment: Resistor 100k +/-1% 0603 100 mW)
R53  value 200k/R0402  [RESC0402(1005)_L]  (hidden comment: Resistor 200K +/-1 % 0402 63 mW)
R54  ValueDisplayed: 75.0k/R0603  [0603]  (hidden comment: RT0603DRE0775KL)
R55  ValueDisplayed: 56  [0402]  (hidden comment: CRCW040256R0JNED)
TP1  TESTPOINT  [TP_50MIL-25MILHOLE]  (value not drawn)  (no BOM)
TP2  TESTPOINT  [TP_50MIL-25MILHOLE]  (value not drawn)  (no BOM)
TP3  TESTPOINT  [TP_50MIL-25MILHOLE]  (value not drawn)  (no BOM)
TP4  TESTPOINT  [TP_50MIL-25MILHOLE]  (value not drawn)  (no BOM)
U1#2  TMS320F28388DZWTS  [ZWT0337A-IPC_B]  (parts D,E of 5)
U8  TPS62420DRCR  [DRC0010J]

### Nets
1V2: C36.1 C37.1 C71.2 D2.2(A) L2.2 L5.1 R50.2
3V3: C35.1 C42.1 C53.1 D2.1(K) L1.2 L3.1 L4.1 R44.2 R47.2 R48.2
GND: C35.2 C37.2 C38.1 C39.1 C40.1 C41.1 C42.2 C43.2 C44.1 C45.1 C46.1 C47.1 C48.1 C49.1 C50.1 C51.1 C52.1 C53.2 C54.2 C55.1 C56.1 C57.1 C58.1 C59.1 C60.1 C61.1 C62.1 C63.1 C64.1 C65.1 C66.1 C67.1 C68.1 C69.1 C70.1 C71.1 C72.1 LED1.1(K) R52.1 R53.1 R54.1 R55.1 TP4.1 U1#2.A1(VSS) U1#2.A10(VSS) U1#2.A19(VSS) U1#2.E5(VSS) U1#2.E6(VSS) U1#2.E8(VSS) U1#2.E12(VSS) U1#2.E14(VSS) U1#2.E15(VSS) U1#2.F5(VSS) U1#2.F6(VSS) U1#2.F8(VSS) U1#2.F12(VSS) U1#2.F14(VSS) U1#2.F15(VSS) U1#2.G16(VSS) U1#2.G17(VSS) U1#2.H8(VSS) U1#2.H9(VSS) U1#2.H10(VSS) U1#2.H11(VSS) U1#2.H12(VSS) U1#2.H14(VSS) U1#2.H15(VSS) U1#2.H18(VSSOSC) U1#2.H19(VSSOSC) U1#2.J5(VSS) U1#2.J6(VSS) U1#2.J8(VSS) U1#2.J9(VSS) U1#2.J10(VSS) U1#2.J11(VSS) U1#2.J12(VSS) U1#2.K8(VSS) U1#2.K9(VSS) U1#2.K10(VSS) U1#2.K11(VSS) U1#2.K12(VSS) U1#2.K14(VSS) U1#2.K15(VSS) U1#2.L5(VSS) U1#2.L6(VSS) U1#2.L8(VSS) U1#2.L9(VSS) U1#2.L10(VSS) U1#2.L11(VSS) U1#2.L12(VSS) U1#2.L18(VSS) U1#2.M8(VSS) U1#2.M9(VSS) U1#2.M10(VSS) U1#2.M11(VSS) U1#2.M12(VSS) U1#2.M14(VSS) U1#2.M15(VSS) U1#2.N1(VSS) U1#2.N5(VSS) U1#2.N6(VSS) U1#2.P1(VSSA) U1#2.P5(VSSA) U1#2.P7(VSS) U1#2.P8(VSS) U1#2.P11(VSS) U1#2.P12(VSS) U1#2.P14(VSS) U1#2.P15(VSS) U1#2.R5(VSSA) U1#2.R7(VSS) U1#2.R8(VSS) U1#2.R14(VSS) U1#2.R15(VSS) U1#2.V7(VSSA) U1#2.W1(VSSA) U1#2.W7(VSS) U1#2.W19(VSS) U8.8(GND) U8.11(PAD)
HSEC_5V0: D1.2(A) TP1.1
IN_5V0: C38.2 C39.2 D1.1(K) R45.2 R46.2 R51.2 U8.3(VIN)
VDD_1V2: C44.2 C45.2 C46.2 C47.2 C48.2 C49.2 C50.2 C72.2 L5.2 R55.2 TP3.1 U1#2.E9(VDD) U1#2.E11(VDD) U1#2.F9(VDD) U1#2.F11(VDD) U1#2.G14(VDD) U1#2.G15(VDD) U1#2.J14(VDD) U1#2.J15(VDD) U1#2.K5(VDD) U1#2.K6(VDD) U1#2.P10(VDD) U1#2.P13(VDD) U1#2.R10(VDD) U1#2.R13(VDD)
VDD_3V3: C43.1 C55.2 C56.2 C57.2 C58.2 C59.2 C60.2 C61.2 C62.2 C63.2 C64.2 C65.2 C66.2 C67.2 C68.2 C69.2 C70.2 L3.2 TP2.1 U1#2.A9(VDDIO) U1#2.A18(VDDIO) U1#2.B1(VDDIO) U1#2.E7(VDDIO) U1#2.E10(VDDIO) U1#2.E13(VDDIO) U1#2.E16(VDDIO) U1#2.F4(VDDIO) U1#2.F7(VDDIO) U1#2.F10(VDDIO) U1#2.F13(VDDIO) U1#2.F16(VDDIO) U1#2.G4(VDDIO) U1#2.G5(VDDIO) U1#2.G6(VDDIO) U1#2.H5(VDDIO) U1#2.H6(VDDIO) U1#2.H16(VDDIO) U1#2.H17(VDDIO) U1#2.L14(VDDIO) U1#2.L15(VDDIO) U1#2.M1(VDDIO) U1#2.M5(VDDIO) U1#2.M6(VDDIO) U1#2.N14(VDDIO) U1#2.N15(VDDIO) U1#2.P9(VDDIO) U1#2.R9(VDDIO) U1#2.R11(VDDIO) U1#2.R12(VDDIO) U1#2.V19(VDDIO) U1#2.W8(VDDIO)
VDDA_3V3: C51.2 C52.2 C54.1 L4.2 U1#2.P6(VDDA) U1#2.R6(VDDA)
NetC36_2: C36.2 R50.1 R53.2 U8.1(ADJ2)
NetC40_2: C40.2 R45.1 U8.9(EN2)
NetC41_2: C41.2 R46.1 U8.7(EN1)
NetL1_1: L1.1 U8.6(SW1)
NetL2_1: L2.1 U8.10(SW2)
NetLED1_2: LED1.2(A) R47.1
NetR44_1: R44.1 U8.4(FB1)
NetR48_1: R48.1 R49.2
NetR49_1: R49.1 R54.2 U8.5(DEF_1)
NetR51_1: R51.1 R52.2 U8.2(MODE_DATA)

### Notes on the sheet
- 1.2V and 3.3V supplies

### Library data of the parts
C35 C37 = CMP-0007324-5: CAP, CERM, 22 uF, 10 V, +/- 20%, X5R, 0603; Manufacturer: MuRata; TaMin_C: -55°C; Polarized: N; SizeAreaWB_mm2: 4.68; Value1: Unknown; U/M: EA; Value: 22uF; TaMax_C: 85°C; SizeZ_mm: 1; SizeX_mm: 1.6; SizeY_mm: 0.8; Value2: 10V; SizeArea_mm2: 1.28; CompType: Capacitor; Cap_F: 22µF; AEC Category: Q200; Supplier Part Number 2: 68X2786; Publisher: Texas Instruments; Supplier 2: Newark; Supplier Part Number 3: 81-GRM188R61A226ME5D; TempCo: X5R; Supplier 3: Mouser; Published: 2008-06-19; RoHS: Y; MountType: SMT; Supplier 1: Digi-Key; PackageReference: 0603; Tolerance_%: 20%; Cap_Case: 0603; LatestRevisionDate: 2017-03-09; PartNumber: GRM188R61A226ME15D; AEC Qualified: ?; ComponentLink1Description: Datasheet link; Supplier Part Number 1: 490-10476-1-ND; Technology: Ceramic; ComponentLink1URL: http://psearch.murata.com/capacitor/product/GRM188R61A226ME15%23.pdf
C36 = CMP-0006213-2: CAP, CERM, 33 pF, 25 V, +/- 5%, C0G/NP0, 0402; Manufacturer: Wurth Elektronik; TaMin_C: -55°C; Polarized: N; SizeAreaWB_mm2: 3; Value1: Unknown; U/M: EA; Value: 33pF; TaMax_C: 125°C; SizeZ_mm: 0.6; SizeX_mm: 1; SizeY_mm: 0.5; Value2: 25V; CompType: Capacitor; AEC Category: Q200; Publisher: Texas Instruments; TempCo: C0G/NP0; Published: 2008-06-19; RoHS: Y; MountType: SMT; Supplier 1: Mouser; PackageReference: 0402; Tolerance_%: 5%; Cap_Case: 0402; SizeArea_mm2: 0.5; LatestRevisionDate: 2017-03-09; PartNumber: 885012005043; AEC Qualified: N; Cap_F: 33pF; ComponentLink1Description: Datasheet link; Supplier Part Number 1: 710-885012005043; Technology: Ceramic; ComponentLink1URL: http://katalog.we-online.de/pbs/datasheet/885012005043.pdf; AEC Grade: N/A; VDC_V: 25V
C38 C40 C41 C44-C52 C55-C70 = CMP-001-00001-6: Chip Capacitor, 0.1 uF, +/- 5%, 16 V, 0402 (1005 Metric); Capacitor Type: Ceramic; Voltage Rating: 16V; Max Operating Temperature: 125°C; Min Operating Temperature: -55°C; Case/Package: 0402; Mounting Technology: SM; Pins: 2; Tolerance: 5%; RoHS Compliant: True
C39 = CMP-001-00081-4: Chip Capacitor, 22µF +/-40%, 16V, 0805, Thickness 1.45 mm; Tolerance: 5%; Voltage Rating: 16V; Mounting Technology: SMT; Pins: 2; Max Operating Temperature: 85°C; Case/Package: 0805; Min Operating Temperature: -55°C
C42 C43 C53 C54 = CMP-0006906-5: CAP, CERM, 2.2 uF, 10 V, +/- 10%, X5R, 0603; Manufacturer: Kemet; TaMin_C: -55°C; Polarized: N; SizeAreaWB_mm2: 4.68; Value1: Unknown; U/M: EA; Value: 2.2uF; TaMax_C: 85°C; SizeZ_mm: 1; SizeX_mm: 1.6; SizeY_mm: 0.8; Value2: 10V; SizeArea_mm2: 1.28; CompType: Capacitor; Cap_F: 2.2µF; AEC Category: Q200; Supplier Part Number 2: 80-C0603C225K8P; Publisher: Texas Instruments; Supplier 2: Mouser; Supplier Part Number 3: 1108322; TempCo: X5R; Supplier 3: Farnell; Published: 2008-06-19; RoHS: Y; MountType: SMT; Supplier 1: Digi-Key; PackageReference: 0603; Tolerance_%: 10%; Cap_Case: 0603; LatestRevisionDate: 2017-03-09; PartNumber: C0603C225K8PACTU; AEC Qualified: ?; ComponentLink1Description: Datasheet link; Supplier Part Number 1: 399-4911-1-ND; Technology: Ceramic; ComponentLink1URL: http://www.kemet.com/kemet/web/homepage/kechome.nsf/vapubfiles/F3102_Y5V.pdf/$file/F3102_Y5V.pdf
C71 C72 = CMP-001-00075-4: Chip Capacitor, 10µF +/-20%, 10V, 0603, Thickness 1 mm; Tolerance: 10%; Voltage Rating: 10V; Max Operating Temperature: 85°C; Pins: 2; Case/Package: 0603; Mounting Technology: SMT; Min Operating Temperature: -55°C
D1 = CMP-004-00076-1: Diode, Schottky, 10 V, 1 A, AEC-Q101, POWERMITE; PartNumber: MBRM110ET1G; Manufacturer: ON Semiconductor; Vf_V: 530mV; VALUE: 10V; Green_REACh: Incomplete; Io_A: 1A; SizeZ_mm: 1.15; AEC Category: Q101; SizeX_mm: 3.9; AEC Qualified: Y; Value2: 0.53V; SizeAreaWB_mm2: 14.945; SizeArea_mm2: 7.995; Tjmax_C: 150°C; Green_Lifecycle: Not Set; SizeY_mm: 2.05; Available Preview Images: 2D; ComponentLink1Description: Datasheet link; Vr_V: 10V; MountType: SMT; Value1: 1A; CompType: Diode; Green_EU RoHS: Incomplete; Green_EU RoHS-2: Incomplete; ComponentLink1URL: http://www.onsemi.com/pub_link/Collateral/MBRM110E-D.PDF; RoHS: Y; Type: Schottky; Source: MCU063B.SCHLIB; Case/Package: POWERMITE; Design Item ID: CMP-0028747-2
D2 = CMP-004-00069-1: SURFACE MOUNT SILICON LOW VF SCHOTTKY DIODE 0.5 AMP; Manufacturer_Name: Central Semiconductor; Manufacturer_Part_Number: CFSH05-20L TR PBFREE; Source: SamacSys.SchLib; Arrow Price/Stock: https://www.arrow.com/en/products/cfsh05-20ltrpbfree/central-semiconductor?region=nac; Datasheet Link: https://my.centralsemi.com/get_document.php?cmp=1&mergetype=pd&mergepath=pd&pdf_id=CFSH05-20L.PDF; Arrow Part Number: CFSH05-20L TR PBFREE; Design Item ID: CFSH05-20L_TR_PBFREE; Height: 0.4mm; Mouser Price/Stock: https://www.mouser.co.uk/ProductDetail/Central-Semiconductor/CFSH05-20L-TR-PBFREE?qs=u16ybLDytRbLc8US0gUlgw%3D%3D; Mouser Part Number: 610-CFSH05-20LTR
L1 L2 = CMP-006-00009-6: Chip Inductor, 2.2 uH, +/- 20%, -55 to 125 degC, 1008 (2520 Metric), RoHS, Tape and Reel; Manufacturer: Murata; Self Resonant Frequency: 40MHz; Current Rating: 1.3A; Core Material: Ferrite; Shielding: Shielded; Package Description: 2-Pin Surface Mounted Device, Body 2.5 x 2 mm; Tolerance: 20%; Max Operating Temperature: 125°C; Mounting Technology: SM; Package Reference: 1008; Case/Package: 1008; RoHS Compliant: True; Package Quantity: 3000; Packaging: TapeandReel; Min Operating Temperature: -55°C; Datasheet URL: http://psearch.en.murata.com/inductor/product/LQM2HPN2R2MG0%23.pdf; Datasheet Version: Aug-16
L3-L5 = CMP-006-00004-3: Chip Ferrite Bead for General Use, 120 Ohm, 500 mA, -55 to 125 degC, 0603 (1608 Metric), RoHS, Tape and Reel; Manufacturer: Murata; Max Current Rating: 500mA; Tolerance: 25%; Impedance: 120Ohm; Resistance: 200mohm; Min Operating Temperature: -55°C; Package Reference: BLM18_H950-2; Max Operating Temperature: 125°C; Current Rating: 500mA; Core Material: Ferrite; Datasheet Version: Jun-12; Packaging: TapeandReel; Datasheet URL: https://statics3.seeedstudio.com/images/opl/datasheet/303010016.pdf; Package Quantity: 4000; Case/Package: 0603; RoHS Compliant: True
LED1 = CMP-007-00038-1: WL-SMCW SMT Mono-Color Chip LED Waterclear 0805; Manufacturer_Name: Wurth Elektronik; Datasheet Link: https://www.we-online.com/components/products/download/Download_3D_150080VS75000+%28rev1%29.pdf; Manufacturer_Part_Number: 150080VS75000; Mouser Price/Stock: https://www.mouser.co.uk/ProductDetail/Wurth-Elektronik/150080VS75000?qs=LlUlMxKIyB0tGHJmO6%252B0ug%3D%3D; Source: SamacSys.SchLib; Design Item ID: 150080VS75000; Height: 0.7mm; Mouser Part Number: 710-150080VS75000
R44 = CMP-009-00005-5: Chip Resistor, 0 Ohm, 0.1 W, -55 to 155 degC, 0402 (1005 Metric); Power: 100mW; Voltage Rating: 50V; Pins: 2; Tolerance: 5%; Case/Package: 0402; Mounting Technology: SM; Max Operating Temperature: 155°C; Min Operating Temperature: -55°C; RoHS Compliant: True
R45 = CMP-009-00081-2: 22K 0.063W 1% 0402 (1005 Metric)  SMD; Power: 63mW; Tolerance: 1%; Pins: 2; Mounting Technology: SMT; Case/Package: 0402
R46 = CMP-009-00006-5: Chip Resistor, 0 Ohm, 0.1 W, -55 to 155 degC, 0603 (1608 Metric); Power: 100mW; Voltage Rating: 50V; Max Operating Temperature: 155°C; RoHS Compliant: True; Mounting Technology: SM; Case/Package: 0603; Min Operating Temperature: -55°C; Tolerance: 5%; Pins: 2
R47 = CMP-0026962-3: RES, 680, 5%, 0.063 W, AEC-Q200 Grade 0, 0402; Manufacturer: Vishay-Dale; CompType: Resistor; Value: 680; Value_Code: 680R; Power_W: 63mW; Value2: 0.063W; VDC_V: 50V; TempCo: 200 ppm/C; EIA_Code: E24; AEC Category: Q200; AEC Qualified: Y; AEC Grade: 0; SizeArea_mm2: 0.5; SizeX_mm: 1; SizeZ_mm: 0.6; PartNumber: CRCW0402680RJNED; PackageReference: 0402; RoHS: E; Res_ohm: 680; Tolerance_%: 5%; Value1: 5%; MountType: SMT; Technology: Thick Film; ComponentLink1Description: Datasheet link; ComponentLink1URL: http://www.vishay.com/docs/20035/dcrcwe3.pdf; Supplier 1: Digi-Key; Supplier Part Number 1: 541-680JCT-ND; Supplier 2: Newark; Supplier Part Number 2: 59M6744; Supplier 3: Mouser; Supplier Part Number 3: 71-CRCW0402J-680-E3; SizeY_mm: 0.5
R48 = CMP-0026300-2: RES, 340 k, 1%, 0.063 W, AEC-Q200 Grade 0, 0402; Manufacturer: Vishay-Dale; Power_W: 63mW; TempCo: 100 ppm/C; Value_Code: 340k; Value: 340k; EIA_Code: E96; SizeX_mm: 1; SizeY_mm: 0.5; SizeZ_mm: 0.6; Value2: 0.063W; CompType: Resistor; AEC Qualified: Y; VDC_V: 50V; AEC Category: Q200; AEC Grade: 0; ComponentLink1URL: http://www.vishay.com/docs/20035/dcrcwe3.pdf; Supplier Part Number 2: 52K6992; Supplier 2: Newark; Supplier Part Number 3: 71-CRCW0402-340K-E3; Supplier 3: Mouser; RoHS: E; Value1: 1%; MountType: SMT; Supplier 1: Digi-Key; PackageReference: 0402; Tolerance_%: 1%; Res_ohm: 340k; SizeArea_mm2: 0.5; PartNumber: CRCW0402340KFKED; ComponentLink1Description: Datasheet link; Supplier Part Number 1: 541-340KLCT-ND; Technology: Thick Film
R49 = CMP-0026676-1: RES, 2.00 k, 1%, 0.1 W, AEC-Q200 Grade 0, 0402; Manufacturer: Panasonic; Power_W: 100mW; TempCo: 100 ppm/C; Value_Code: 2k00; U/M: EA; Value: 2.00k; EIA_Code: E96; Res_ohm: 2k; SizeX_mm: 1; SizeY_mm: 0.5; SizeZ_mm: 0.6; Value2: 0.1W; CompType: Resistor; AEC Qualified: Y; VDC_V: 50V; AEC Grade: 0; AEC Category: Q200; ComponentLink1URL: http://industrial.panasonic.com/cdbs/www-data/pdf/RDA0000/AOA0000C86.pdf; Supplier Part Number 2: 73T6486; Publisher: Texas Instruments; Supplier 2: Newark; Supplier Part Number 3: 667-ERJ-2RKF2001X; Supplier 3: Mouser; Published: 2008-06-26; RoHS: Y; Value1: 1%; MountType: SMT; Supplier 1: Digi-Key; PackageReference: 0402; Tolerance_%: 1%; SizeArea_mm2: 0.5; LatestRevisionDate: 2017-03-09; PartNumber: ERJ-2RKF2001X; ComponentLink1Description: Datasheet link; Supplier Part Number 1: P2.00KLCT-ND; Technology: Thick Film
R50 = CMP-0026160-2: RES, 205 k, 1%, 0.063 W, AEC-Q200 Grade 0, 0402; Manufacturer: Vishay-Dale; Power_W: 63mW; TempCo: 100 ppm/C; Value_Code: 205k; Value: 205k; EIA_Code: E96; SizeX_mm: 1; SizeY_mm: 0.5; SizeZ_mm: 0.6; Value2: 0.063W; CompType: Resistor; AEC Qualified: Y; VDC_V: 50V; AEC Category: Q200; AEC Grade: 0; ComponentLink1URL: http://www.vishay.com/docs/20035/dcrcwe3.pdf; Supplier Part Number 2: 52K6827; Supplier 2: Newark; Supplier Part Number 3: 71-CRCW0402-205K-E3; Supplier 3: Mouser; RoHS: E; Value1: 1%; MountType: SMT; Supplier 1: Digi-Key; PackageReference: 0402; Tolerance_%: 1%; Res_ohm: 205k; SizeArea_mm2: 0.5; PartNumber: CRCW0402205KFKED; ComponentLink1Description: Datasheet link; Supplier Part Number 1: 541-205KLCT-ND; Technology: Thick Film
R51 = CMP-009-00066-2: 10K 0.063W 1% 0402 (1005 Metric)  SMD; Power: 63mW; Case/Package: 0402; Mounting Technology: SMT; Pins: 2; Tolerance: 1%
R52 = CMP-009-00023-5: Chip Resistor, 100 KOhm, +/- 1%, 0.1 W, -55 to 155 degC, 0603 (1608 Metric); Voltage Rating: 50V; Power: 100mW; Max Operating Temperature: 155°C; RoHS Compliant: True; Tolerance: 1%; Pins: 2; Case/Package: 0603; Mounting Technology: SM; Min Operating Temperature: -55°C
R53 = CMP-009-00163-3: Chip Resistor, 200 kOhms, +/-1 %, 63 mW, -55 to 155 degC, 0402; Power: 63mW; Tolerance: 1%; Min Operating Temperature: -55°C; Max Operating Temperature: 155°C; Case/Package: 0402; Pins: 2
R54 = CMP-0025557-3: RES, 75.0 k, 0.5%, 0.1 W, 0603; Manufacturer: Yageo America; Power_W: 100mW; TempCo: 50 ppm/C; Value_Code: 75k0; U/M: EA; Value: 75.0k; EIA_Code: E192; Res_ohm: 75k; SizeX_mm: 1.6; SizeY_mm: 0.8; SizeZ_mm: 1; Value2: 0.1W; SizeArea_mm2: 1.28; CompType: Resistor; VDC_V: 75V; AEC Category: Q200; Publisher: Texas Instruments; Published: 2008-06-26; RoHS: Y; Value1: 0.5%; MountType: SMT; PackageReference: 0603; Tolerance_%: 0.5%; LatestRevisionDate: 2017-03-09; PartNumber: RT0603DRE0775KL; AEC Qualified: ?; ComponentLink1Description: Datasheet link; Technology: Thin Film; ComponentLink1URL: http://www.yageo.com/pdf/PYu-RT_1-to-0.05_RoHS_L_3.pdf
R55 = CMP-0026950-3: RES, 56, 5%, 0.063 W, AEC-Q200 Grade 0, 0402; Manufacturer: Vishay-Dale; Power_W: 63mW; TempCo: 200 ppm/C; Value_Code: 56R0; Value: 56; EIA_Code: E24; SizeX_mm: 1; SizeY_mm: 0.5; SizeZ_mm: 0.6; Value2: 0.063W; CompType: Resistor; AEC Qualified: Y; VDC_V: 50V; AEC Category: Q200; AEC Grade: 0; Supplier Part Number 2: 89M6681; Supplier 2: Newark; Supplier Part Number 3: 71-CRCW0402J-56-E3; Supplier 3: Mouser; RoHS: E; Value1: 5%; MountType: SMT; Supplier 1: Digi-Key; PackageReference: 0402; Tolerance_%: 5%; Res_ohm: 56; SizeArea_mm2: 0.5; PartNumber: CRCW040256R0JNED; ComponentLink1Description: Datasheet link; Supplier Part Number 1: 541-56JCT-ND; Technology: Thick Film; ComponentLink1URL: http://www.vishay.com/docs/20035/dcrcwe3.pdf
TP1-TP4 = CMP-0078143-3: TEST POINT.  No entry in BOM.; CompType: Testpoint; PackageReference: N/A; Manufacturer: N/A; PartNumber: N/A; Library Reference: TESTPOINT
U1#2 = CMP-012-000147-1: TMS320F28388DZWTS, ZWT0337A (NFBGA-337); Alternate Manufacturer: Texas Instruments; SizeY_mm: 16; SizeArea_mm2: 256; AEC Qualified: N; SizeAreaWB_mm2: 324; SizeZ_mm: 1.4; Available Preview Images: 2D; CompType: IC; AEC Category: Q200; ComponentLink2URL: http://www.ti.com/product/tms320f28388d; MountType: SMT; ComponentLink3Description: Online Datasheet; PackageDescription: NFBGA-337; ComponentLink3URL: http://www.ti.com/product/tms320f28388d/datasheet; SizeX_mm: 16; Design Item ID: TMS320F28388DZWTS; ComponentLink1URL: http://www.ti.com/lit/ds/symlink/tms320f28388d.pdf; Source: SamacSys.SchLib; ComponentLink2Description: Product Folder; PackageReference: ZWT0337A; Manufacturer: Texas Instruments; ComponentLink1Description: Datasheet Link
U8 = CMP-014-000012-1: Dual, Adjustable, 600mA and 1000mA, 2.25MHz Step-Down Converter with 1-Wire Interface in QFN 10-VSON -40 to 85; Manufacturer: Texas Instruments; Alternate_PartNumber: TPS62420DRCT; CompType: IC; RefDes: RefDes; TYPE: TYPE; Source: SamacSys.SchLib; PartNumber: TPS62420DRCR; MountType: SMT; Copyright: Copyright (C) 2025 Ultra Librarian. All rights reserved.; RoHS: Y; Application_BuildNumber: *; Manufacturer_Name: Texas Instruments; Design Item ID: TPS62420DRCR; Manufacturer_Part_Number: TPS62420DRCR; PackageReference: DRC0010J

## Sheet 5.ETH.SchDoc
size A3; SheetNumber: 6; SheetTotal: 10
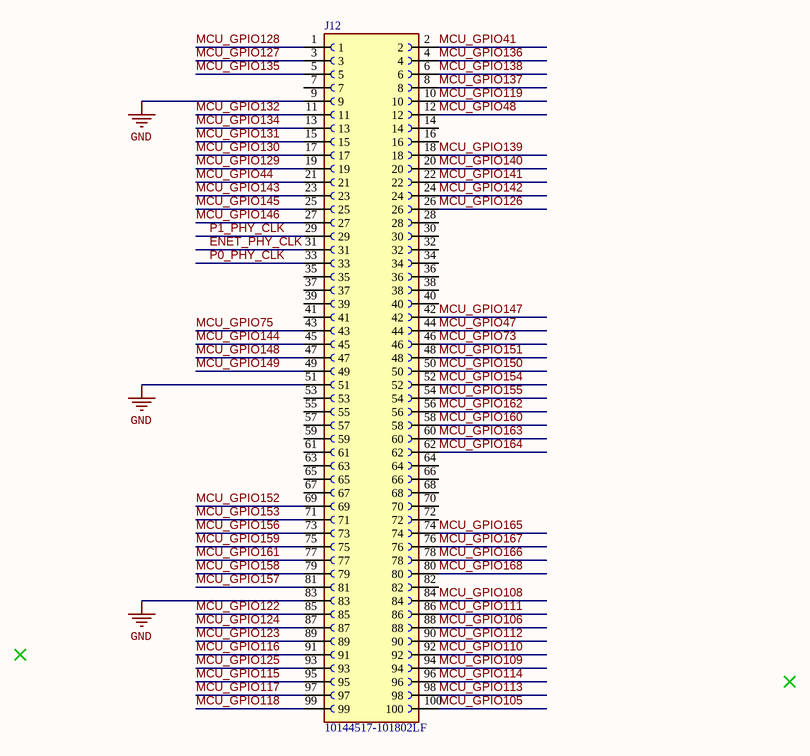
[diagram p5: 5.ETH.SchDoc]

### Parts
J12  10144517-101802LF  [AMPHENOL_10144517-101802LF]

### Nets
GND: J12.9 J12.51 J12.83
ENET_PHY_CLK: J12.31
MCU_GPIO41: J12.2
MCU_GPIO44: J12.21
MCU_GPIO47: J12.44
MCU_GPIO48: J12.12
MCU_GPIO73: J12.46
MCU_GPIO75: J12.43
MCU_GPIO105: J12.100
MCU_GPIO106: J12.88
MCU_GPIO108: J12.84
MCU_GPIO109: J12.94
MCU_GPIO110: J12.92
MCU_GPIO111: J12.86
MCU_GPIO112: J12.90
MCU_GPIO113: J12.98
MCU_GPIO114: J12.96
MCU_GPIO115: J12.95
MCU_GPIO116: J12.91
MCU_GPIO117: J12.97
MCU_GPIO118: J12.99
MCU_GPIO119: J12.10
MCU_GPIO122: J12.85
MCU_GPIO123: J12.89
MCU_GPIO124: J12.87
MCU_GPIO125: J12.93
MCU_GPIO126: J12.26
MCU_GPIO127: J12.3
MCU_GPIO128: J12.1
MCU_GPIO129: J12.19
MCU_GPIO130: J12.17
MCU_GPIO131: J12.15
MCU_GPIO132: J12.11
MCU_GPIO134: J12.13
MCU_GPIO135: J12.5
MCU_GPIO136: J12.4
MCU_GPIO137: J12.8
MCU_GPIO138: J12.6
MCU_GPIO139: J12.18
MCU_GPIO140: J12.20
MCU_GPIO141: J12.22
MCU_GPIO142: J12.24
MCU_GPIO143: J12.23
MCU_GPIO144: J12.45
MCU_GPIO145: J12.25
MCU_GPIO146: J12.27
MCU_GPIO147: J12.42
MCU_GPIO148: J12.47
MCU_GPIO149: J12.49
MCU_GPIO150: J12.50
MCU_GPIO151: J12.48
MCU_GPIO152: J12.69
MCU_GPIO153: J12.71
MCU_GPIO154: J12.52
MCU_GPIO155: J12.54
MCU_GPIO156: J12.73
MCU_GPIO157: J12.81
MCU_GPIO158: J12.79
MCU_GPIO159: J12.75
MCU_GPIO160: J12.58
MCU_GPIO161: J12.77
MCU_GPIO162: J12.56
MCU_GPIO163: J12.60
MCU_GPIO164: J12.62
MCU_GPIO165: J12.74
MCU_GPIO166: J12.78
MCU_GPIO167: J12.76
MCU_GPIO168: J12.80
P0_PHY_CLK: J12.33
P1_PHY_CLK: J12.29

Not connected (* = marked no-connect by the designer): J12 7 14 16 28 30 32 34 35 36 37 38 39 40 41 53 55 57 59 61 63 64 65 66 67 68 70 72 82

### Library data of the parts
J12 = CMP-002-00178-1: Socket(male) 100 Positions, Dual Row, Vertical Receptacle. BergStak Lite 0.80mm, Board-to-Board Connector,; MF: AMPHENOL ICC / FCI; Source: SamacSys.SchLib; Check_prices: https://www.snapeda.com/parts/10144517-101802LF/Amphenol/view-part/?ref=eda; Value: *; Case/Package: None; MP: 10144517-101802LF; Design Item ID: 10144517-101802LF; SnapEDA_Link: https://www.snapeda.com/parts/10144517-101802LF/Amphenol/view-part/?ref=snap

## Sheet 6.ETCAT.SchDoc
size A3; SheetNumber: 7; SheetTotal: 11
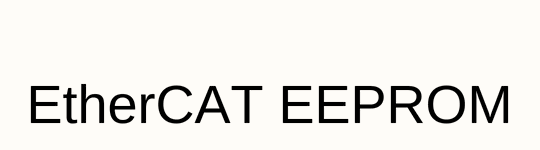
[diagram p6: 6.ETCAT.SchDoc]

### Notes on the sheet
- EtherCAT EEPROM

## Sheet 7.Emulator.SchDoc
size A3; SheetNumber: 8; SheetTotal: 10

## Sheet 8.Emulator_Interface.SchDoc
size A3; SheetNumber: 9; SheetTotal: 10
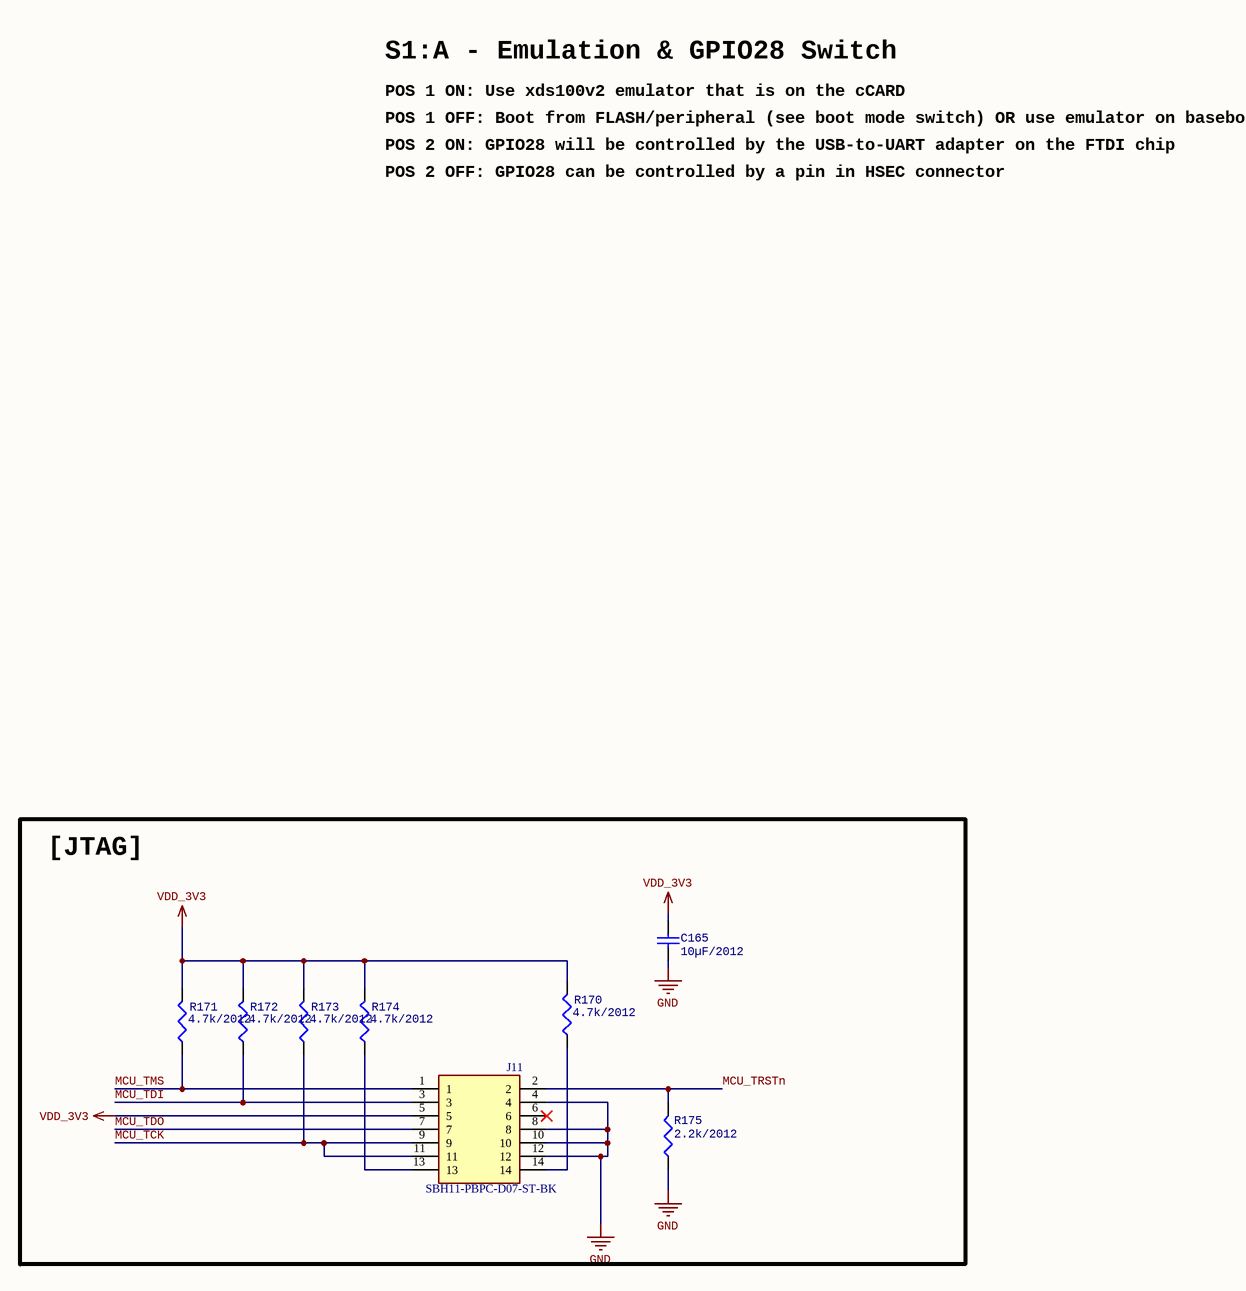
[diagram p7: 8.Emulator_Interface.SchDoc]

### Parts
C165  value 10µF/2012  [CAPC2013X135X45NL10T25]  (hidden comment: C2012)
J11  SBH11-PBPC-D07-ST-BK  [SULLINS_SBH11-PBPC-D07-ST-BK]
R170  value 4.7k/2012  [RESC0805(2012)_L]  (hidden comment: R2012)
R171  value 4.7k/2012  [RESC0805(2012)_L]  (hidden comment: R2012)
R172  value 4.7k/2012  [RESC0805(2012)_L]  (hidden comment: R2012)
R173  value 4.7k/2012  [RESC0805(2012)_L]  (hidden comment: R2012)
R174  value 4.7k/2012  [RESC0805(2012)_L]  (hidden comment: R2012)
R175  value 2.2k/2012  [RESC0805(2012)_L]  (hidden comment: R2012)

### Blocks framed on the sheet
[JTAG]: C165 J11 R170-R175

### Nets
GND: C165.2 J11.4 J11.8 J11.10 J11.12 R175.1
VDD_3V3: C165.1 J11.5 R170.2 R171.2 R172.2 R173.2 R174.2
MCU_TCK: J11.9 J11.11 R173.1
MCU_TDI: J11.3 R172.1
MCU_TDO: J11.7
MCU_TMS: J11.1 R171.1
MCU_TRSTn: J11.2 R175.2
NetJ11_13: J11.13 R174.1
NetJ11_14: J11.14 R170.1

Not connected (* = marked no-connect by the designer): J11 6*

### Notes on the sheet
- S1:A - Emulation & GPIO28 Switch
- POS 1 ON: Use xds100v2 emulator that is on the cCARD
- POS 1 OFF: Boot from FLASH/peripheral (see boot mode switch) OR use emulator on baseboard
- POS 2 ON: GPIO28 will be controlled by the USB-to-UART adapter on the FTDI chip
- POS 2 OFF: GPIO28 can be controlled by a pin in HSEC connector

### Library data of the parts
C165 = CMP-001-00007-7: Chip Capacitor, 1 uF, +/- 10%, 50 V, 0805 (2012 Metric); Voltage Rating: 50V; Capacitor Type: Ceramic; Case/Package: 0805; Min Operating Temperature: -55°C; Max Operating Temperature: 125°C; Pins: 2; Tolerance: 10%; RoHS Compliant: True; Mounting Technology: SM
J11 = CMP-002-00182-1: Connector Header Through Hole 14 position 0.100 (2.54mm); MF: Sullins Connector; Design Item ID: SBH11-PBPC-D07-ST-BK; Source: SBH11-PBPC-D07-ST-BK.SchLib; MP: SBH11-PBPC-D07-ST-BK; SnapEDA_Link: https://www.snapeda.com/parts/SBH11-PBPC-D07-ST-BK/Sullins/view-part/?ref=snap; Value: *; Check_prices: https://www.snapeda.com/parts/SBH11-PBPC-D07-ST-BK/Sullins/view-part/?ref=eda; Case/Package: None
R170-R175 = CMP-009-00174-4: Chip Resistor, 4,7 Ohms, +/-5 %, 125 mW, -55 to 155 degC, 0805; Power: 125mW; Tolerance: 5%; Max Operating Temperature: 155°C; Pins: 2; Case/Package: 0805; Min Operating Temperature: -55°C